# Altium schematic sheet CSMS.SchDoc
size A4; SheetNumber: 1; SheetTotal: 3
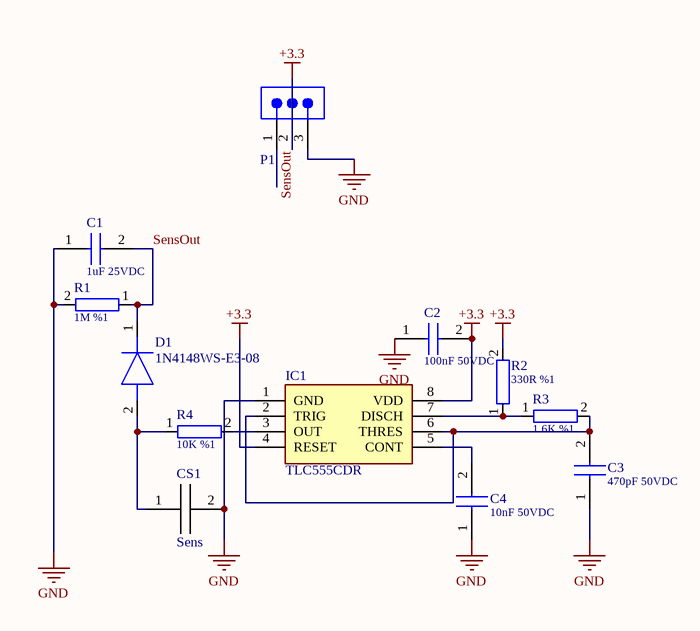
[diagram p0: CSMS.SchDoc]

## Parts
C1  value 1uF 25VDC  [0603 CAP]  (hidden comment: CL10B105KA8NNNC)
C2  value 100nF 50VDC  [0603 CAP]  (hidden comment: CL10B104KB8NNNC)
C3  value 470pF 50VDC  [0603 CAP]  (hidden comment: CL10B471KB8NNNC)
C4  value 10nF 50VDC  [0603 CAP]  (hidden comment: CC0603KRX7R9BB103)
CS1  Sens  [Sens]
D1  1N4148WS-E3-08  [SOD2513X110N]
IC1  TLC555CDR  [SOIC127P600X175-8N]
P1  61300311021  [61300311021]  (value not drawn)
R1  value 1M %1  [0603 RES]  (hidden comment: 0603SAF1004T5E)
R2  value 330R %1  [0603 RES]  (hidden comment: 0603SAF3300T5E)
R3  value 1.6K %1  [0603 RES]  (hidden comment: 0603SAF1601T5E)
R4  value 10K %1  [0603 RES]  (hidden comment: 0603SAF1002T5E)

## Nets
+3.3: C2.2 IC1.4(RESET) IC1.8(VDD) P1.2 R2.2
GND: C1.1 C2.1 C3.1 C4.1 CS1.2 IC1.1(GND) P1.3 R1.2
SensOut: C1.2 D1.1(K) P1.1 R1.1
NetC3_2: C3.2 IC1.2(TRIG) IC1.6(THRES) R3.2
NetC4_2: C4.2 IC1.5(CONT)
NetCS1_1: CS1.1 D1.2(A) R4.1
NetIC1_3: IC1.3(OUT) R4.2
NetIC1_7: IC1.7(DISCH) R2.1 R3.1

## Library data of the parts
C1 = CL10B105KA8NNNC: 1uF 25VDC ±10% X7R MLCC 0603; Ozdisan Price/Stock: https://ozdisan.com/Product/Detail/522144/CL10A106MO8NQNC; Supplier 1: Ozdisan; Supplier Part Number 1: CL10B105KA8NNNC; Supplier 2: Digi-Key; Supplier Part Number 2: 1276-1184-1-ND
C2 = CL10B104KB8NNNC: 100nF 50VDC ±10% X7R MLCC 0603; Ozdisan Price/Stock: https://ozdisan.com/Product/Detail/522144/CL10A106MO8NQNC; Supplier 1: Arrow Electronics; Supplier Part Number 1: CL10B104KB8NNNC
C3 = CL10B471KB8NNNC: 470pF 50VDC ±10% X7R MLCC 0603; Ozdisan Price/Stock: https://ozdisan.com/Product/Detail/522144/CL10A106MO8NQNC; Supplier 1: Mouser; Supplier Part Number 1: 187-CL10B471KB8NNNC
C4 = CC0603KRX7R9BB103: 10nF, 50 V, ± 10%, X7R, 0603, Multilayer Ceramic Capacitor,; Ozdisan Price/Stock: https://ozdisan.com/Product/Detail/522144/CL10A106MO8NQNC; Supplier 1: Digi-Key; Supplier Part Number 1: 311-1085-1-ND
CS1 = Sens: Pcb Sens
D1 = 1N4148WS-E3-08: Diode; Manufacturer_Name: Vishay; Datasheet Link: https://datasheet.datasheetarchive.com/originals/distributors/Datasheets-DGA23/1390442.pdf; Height: 1.15mm; Manufacturer_Part_Number: 1N4148WS-E3-08; Mouser Part Number: 78-1N4148WS-E3-08; Mouser Price/Stock: https://www.mouser.co.uk/ProductDetail/Vishay-Semiconductors/1N4148WS-E3-08?qs=bTzheeSci6R8fv1OBRENhQ%3D%3D; Arrow Part Number: 1N4148WS-E3-08; Arrow Price/Stock: https://www.arrow.com/en/products/1n4148ws-e3-08/vishay?region=europe; Supplier 1: Mouser; Supplier Part Number 1: 78-1N4148WS-E3-08
IC1 = TLC555CDR: 555 Astable 2.1-MHz, 250-µA, Low-Power Timer 8-SOIC 0 to 70; Manufacturer_Name: Texas Instruments; Datasheet Link: https://www.ti.com/lit/ds/symlink/tlc555.pdf?ts=1599218356509&ref_url=https%253A%252F%252Fwww.ti.com%252Fstore%252Fti%252Fen%252Fp%252Fproduct%252F%253Fp%253DTLC555CDR%2526keyMatch%253DTLC555CDR%2526tisearch%253DSearch-EN-everything%2526usecase%253DOPN; Height: 1.75mm; Manufacturer_Part_Number: TLC555CDR; Mouser Part Number: 595-TLC555CDR; Mouser Price/Stock: https://www.mouser.co.uk/ProductDetail/Texas-Instruments/TLC555CDR?qs=gb35HGp1gQImgWgRW%252BGYaw%3D%3D; Arrow Part Number: TLC555CDR; Arrow Price/Stock: https://www.arrow.com/en/products/tlc555cdr/texas-instruments?region=nac; Supplier 1: Mouser; Supplier Part Number 1: 595-TLC555CDR
P1 = 61300311021: WR-PHD Pin Header, THT, Angled, pitch 2.54mm, 1 Row, 3P; Manufacturer: Wurth Elektronik; Contact Resistance: 20mΩ; Rated Current: 3A; Working Voltage: 250V; Withstanding Voltage: 500V; ComponentLink1Description: Website Link; ComponentLink1URL: https://www.we-online.com/redexpert/article/61300311021?ad; ComponentLink2Description: Datasheet Link; ComponentLink2URL: https://www.we-online.com/redexpert/spec/61300311021?ad; Manufacturer Part Number: 61300311021; Category: Board-to-Board Connectors; Match Code: WR-PHD; Mount: Through Hole; Operating Temperature Max: 105°C; Operating Temperature Min: -40°C; Packaging: Bag; Gender: Pin Header; Number of Pins: 3; Number of Rows: 1; Orientation: Angled; Pitch: 2.54mm; Supplier 1: Digi-Key; Supplier Part Number 1: 732-5336-ND
R1 = 0603SAF1004T5E: 1M Ohms 1% 1/10W-S 100PPM RES 0603; Ozdisan Price/Stock: https://ozdisan.com/Product/Detail/522144/CL10A106MO8NQNC; Supplier 1: Newark; Supplier Part Number 1: 79M5904
R2 = 0603SAF3300T5E: 330R Ohms 1% 1/10W-S 100PPM RES 0603; Ozdisan Price/Stock: https://ozdisan.com/Product/Detail/522144/CL10A106MO8NQNC; Supplier 1: Mouser; Supplier Part Number 1: 603-RC0603FR-07330RL
R3 = 0603SAF1601T5E: 1.6K Ohms 1% 1/10W-S 100PPM RES 0603; Ozdisan Price/Stock: https://ozdisan.com/Product/Detail/522144/CL10A106MO8NQNC; Supplier 1: Avnet; Supplier Part Number 1: 39P9958
R4 = 0603SAF1002T5E: 10K Ohms 1% 1/10W-S 100PPM RES 0603; Ozdisan Price/Stock: https://ozdisan.com/Product/Detail/522144/CL10A106MO8NQNC; Supplier 1: Farnell; Supplier Part Number 1: 1632392